# Altium schematic sheet 3 - PSOC & Power.SchDoc
size A3; PageSetup: Record=PageOptions|CenterHorizontal=True|CenterVertical=True|PrintScale=1.00|XCorrection=1.00|YCorrection=1.00|PrintKind=1|BorderSize=5000000|LeftOffset=0|BottomOffset=0|Orientation=2|PaperLength=2970|PaperWidth=2100|Scale=100|PaperSource=7|PrintQuality=-4|MediaType=1|DitherType=10|PaperKind=A4 (210 x 297 mm)|PrintScaleMode=0
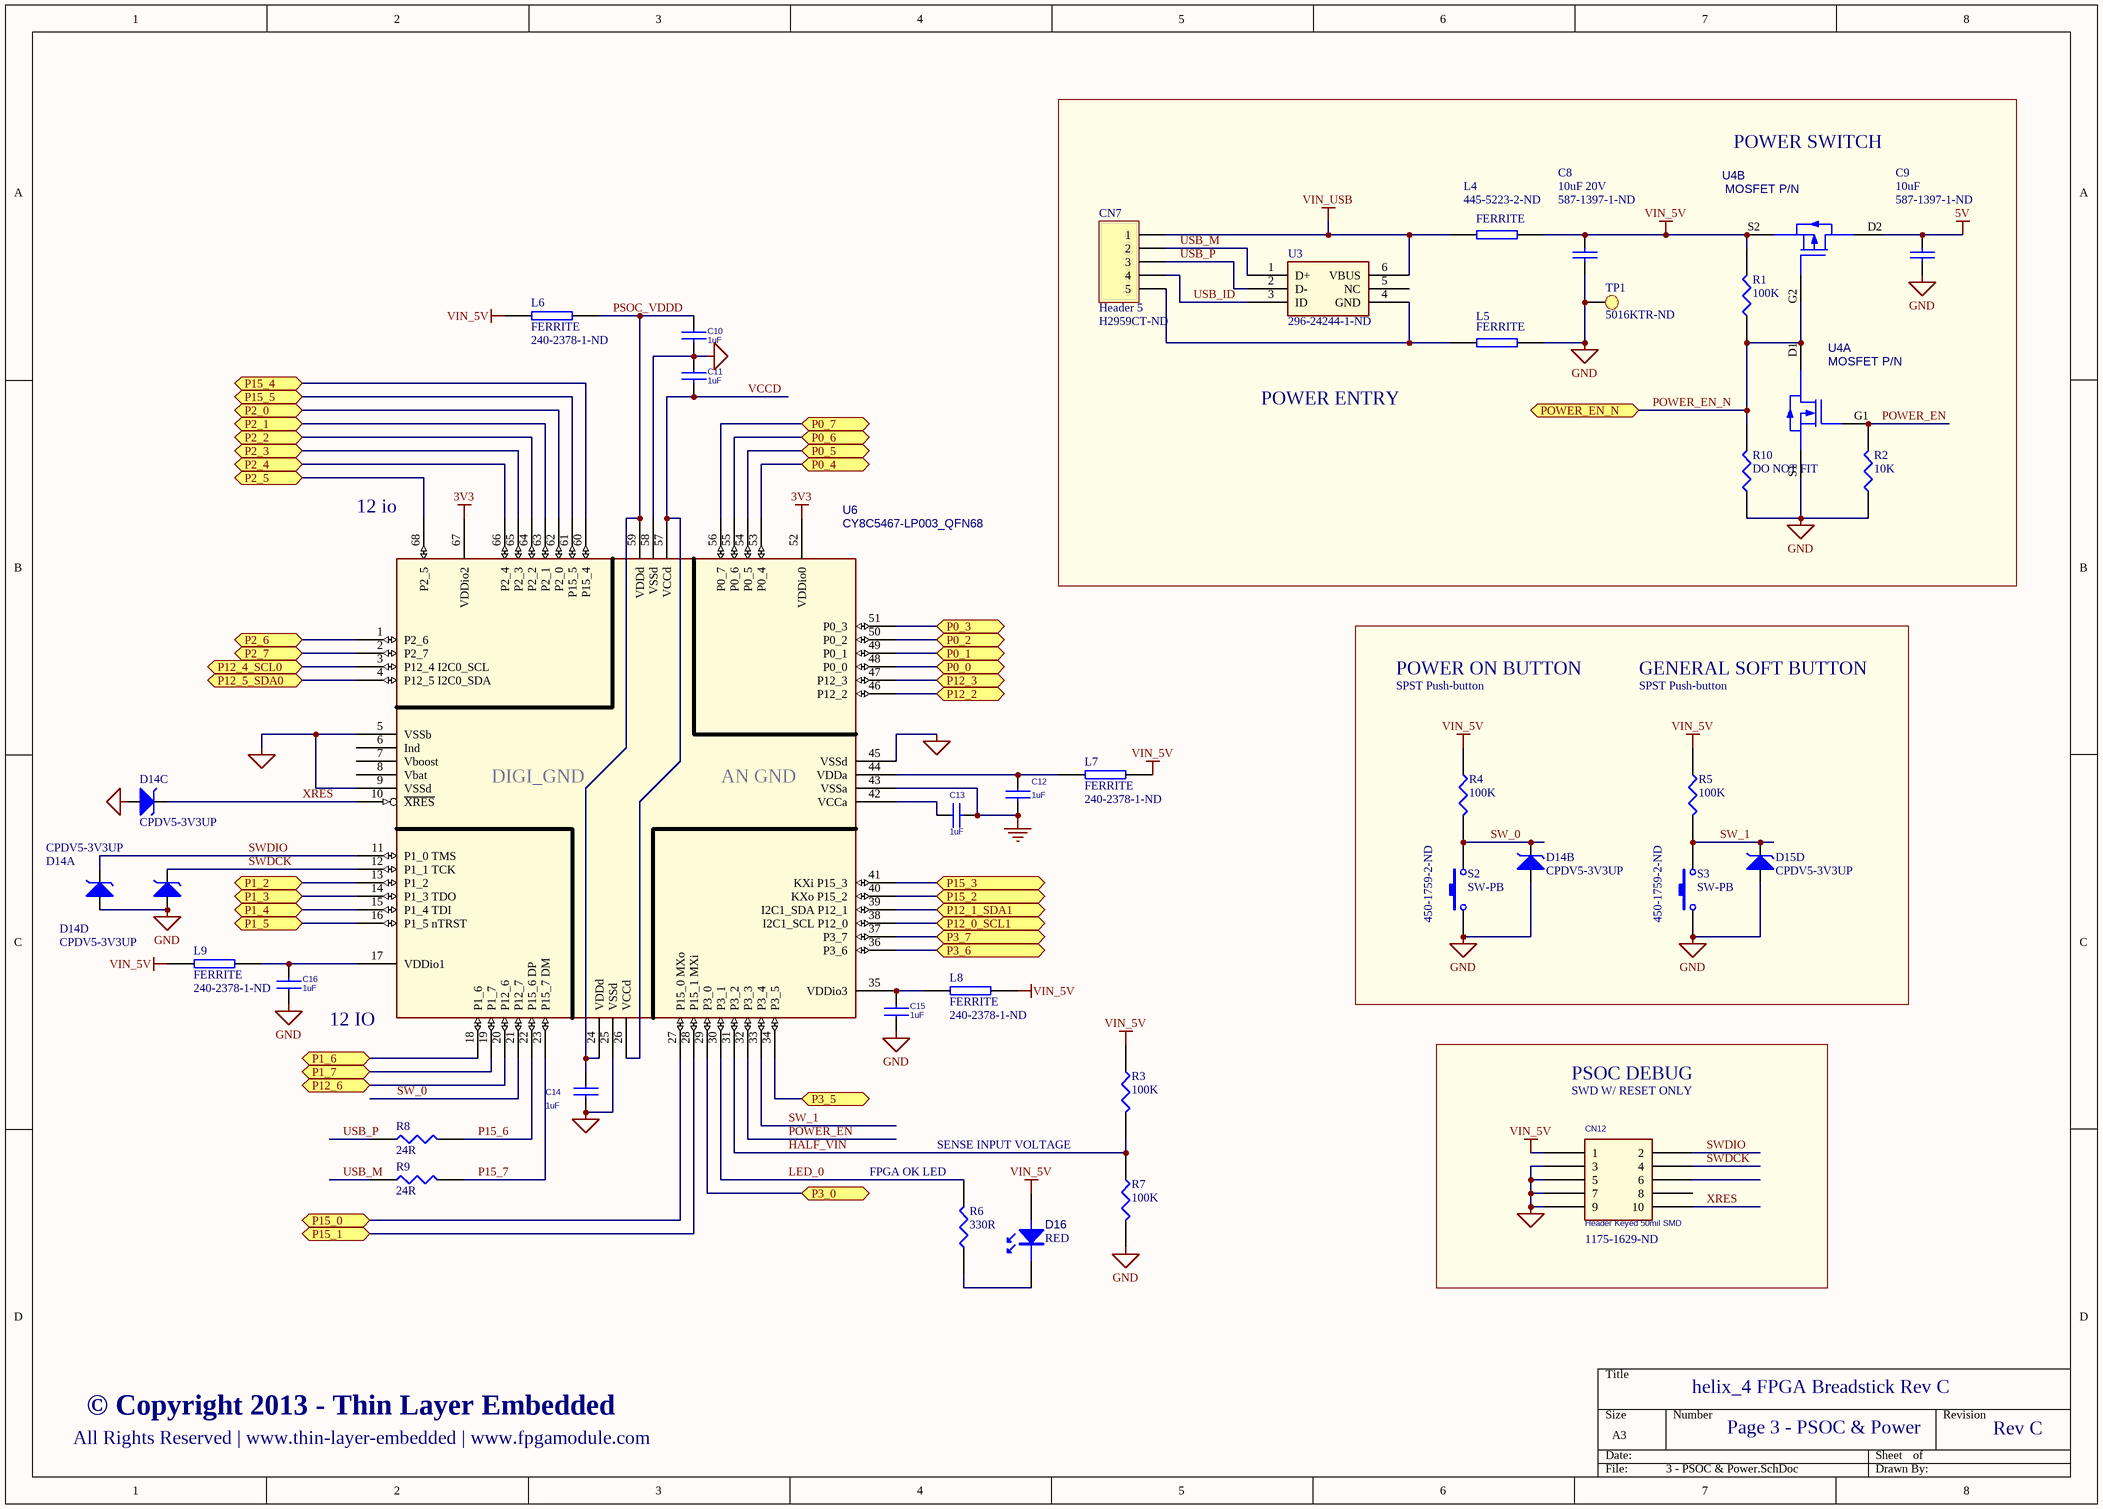
[diagram p0: 3 - PSOC & Power.SchDoc]

## Parts
C8  10uF 20V  Supplier Part Number 1: 587-1397-1-ND  [0805]
C9  10uF  Supplier Part Number 1: 587-1397-1-ND  [0805]
C10  1uF  [0402_HD]
C11  1uF  [0402_HD]
C12  1uF  [0402_HD]
C13  1uF  [0402_HD]
C14  1uF  [0402_HD]
C15  1uF  [0402_HD]
C16  1uF  [0402_HD]
CN7  Header 5  Supplier Part Number 1: H2959CT-ND  [USB_MINI_B]
CN12  Header Keyed 50mil SMD  Supplier Part Number 1: 1175-1629-ND  [SBH41_127_10W_DUAL]
D14  CPDV5-3V3UP  [sot-353]  (parts A,B,C,D of 4)
D15  CPDV5-3V3UP  [sot-353]  (part D of 4)
D16  RED  [0805_HD_LED]
L4  FERRITE  Supplier Part Number 1: 445-5223-2-ND  [0805]
L5  FERRITE  [0805]
L6  FERRITE  Supplier Part Number 1: 240-2378-1-ND  [0402_HD]
L7  FERRITE  Supplier Part Number 1: 240-2378-1-ND  [0402_HD]
L8  FERRITE  Supplier Part Number 1: 240-2378-1-ND  [0402_HD]
L9  FERRITE  Supplier Part Number 1: 240-2378-1-ND  [0402_HD]
R1  100K  [0805]
R2  10K  [0805]
R3  100K  [0805]
R4  100K  [0805]
R5  100K  [0805]
R6  330R  [0805]
R7  100K  [0805]
R8  24R  [0402_HD]
R9  24R  [0402_HD]
R10  DO NOT FIT  [0805]
S2  SW-PB  Supplier Part Number 1: 450-1759-2-ND  [FSM4JSMA]
S3  SW-PB  Supplier Part Number 1: 450-1759-2-ND  [FSM4JSMA]
TP1  Supplier Part Number 2: 5016KTR-ND  [TEST_POINT]  (hidden comment: Test Point)
U3  Supplier Part Number 1: 296-24244-1-ND  [DRY6]  (hidden comment: SN65220 USB TVS SOT23-6_0)
U4  MOSFET P/N  [WSMini6-F1-B]  (parts A,B of 2)
U6  CY8C5467-LP003_QFN68  [PSOC_QFN68_HD]

## Blocks framed on the sheet
PSOC DEBUG: CN12

## Ports
P0_0, P0_1, P0_2, P0_3, P0_4, P0_5, P0_6, P0_7, P1_2, P1_3, P1_4, P1_5, P1_6, P1_7, P2_0, P2_1, P2_2, P2_3, P2_4, P2_5, P2_6, P2_7, P3_0, P3_5, P3_6, P3_7, P12_0_SCL1, P12_1_SDA1, P12_2, P12_3, P12_4_SCL0, P12_5_SDA0, P12_6, P15_0, P15_1, P15_2, P15_3, P15_4, P15_5, POWER_EN_N

## Nets
3V3: U6.52(VDDio0) U6.67(VDDio2)
5V: C9.1 U4.D2
GND: C8.2 C9.2 C10.2 C11.1 C12.2 C13.2 C14.2 C15.1 C16.1 CN12.3 CN12.5 CN12.7 CN12.9 D14.2(A) D15.2(A) L5.2 R2.1 R7.2 R10.1 S2.1 S3.1 TP1.1 U4.S1 U6.5(VSSb) U6.9(VSSd) U6.25(VSSd) U6.43(VSSa) U6.45(VSSd) U6.58(VSSd)
VIN_5V: C8.1 CN12.1 D16.A L4.2 L6.1 L7.2 L8.2 L9.2 R1.2 R3.1 R4.1 R5.1 U4.S2
VIN_USB: CN7.1 L4.1 U3.6(VBUS)
HALF_VIN: R3.2 R7.1 U6.31(P3_2)
LED_0: R6.2 U6.30(P3_1)
P0_0: U6.48(P0_0) ; port P0_0
P0_1: U6.49(P0_1) ; port P0_1
P0_2: U6.50(P0_2) ; port P0_2
P0_3: U6.51(P0_3) ; port P0_3
P0_4: U6.53(P0_4) ; port P0_4
P0_5: U6.54(P0_5) ; port P0_5
P0_6: U6.55(P0_6) ; port P0_6
P0_7: U6.56(P0_7) ; port P0_7
P1_2: U6.13(P1_2) ; port P1_2
P1_3: U6.14(P1_3_TDO) ; port P1_3
P1_4: U6.15(P1_4_TDI) ; port P1_4
P1_5: U6.16(P1_5_nTRST) ; port P1_5
P1_6: U6.18(P1_6) ; port P1_6
P1_7: U6.19(P1_7) ; port P1_7
P2_0: U6.62(P2_0) ; port P2_0
P2_1: U6.63(P2_1) ; port P2_1
P2_2: U6.64(P2_2) ; port P2_2
P2_3: U6.65(P2_3) ; port P2_3
P2_4: U6.66(P2_4) ; port P2_4
P2_5: U6.68(P2_5) ; port P2_5
P2_6: U6.1(P2_6) ; port P2_6
P2_7: U6.2(P2_7) ; port P2_7
P3_0: U6.29(P3_0) ; port P3_0
P3_5: U6.34(P3_5) ; port P3_5
P3_6: U6.36(P3_6) ; port P3_6
P3_7: U6.37(P3_7) ; port P3_7
P12_0_SCL1: U6.38(I2C1_SCL_P12_0) ; port P12_0_SCL1
P12_1_SDA1: U6.39(I2C1_SDA_P12_1) ; port P12_1_SDA1
P12_2: U6.46(P12_2) ; port P12_2
P12_3: U6.47(P12_3) ; port P12_3
P12_4_SCL0: U6.3(P12_4_I2C0_SCL) ; port P12_4_SCL0
P12_5_SDA0: U6.4(P12_5_I2C0_SDA) ; port P12_5_SDA0
P12_6: U6.20(P12_6) ; port P12_6
P15_0: U6.27(P15_0_MXo) ; port P15_0
P15_1: U6.28(P15_1_MXi) ; port P15_1
P15_2: U6.40(KXo_P15_2) ; port P15_2
P15_3: U6.41(KXi_P15_3) ; port P15_3
P15_4: U6.60(P15_4) ; port P15_4
P15_5: U6.61(P15_5) ; port P15_5
P15_6: R8.1 U6.22(P15_6_DP)
P15_7: R9.1 U6.23(P15_7_DM)
POWER_EN: R2.2 U4.G1 U6.32(P3_3)
POWER_EN_N: R1.1 R10.2 U4.D1 U4.G2 ; port POWER_EN_N
PSOC_VDDD: C10.1 C14.1 L6.2 U6.24(VDDd) U6.59(VDDd)
SW_0: D14.1(K2) R4.2 S2.2 U6.21(P12_7)
SW_1: D15.4(K4) R5.2 S3.2 U6.33(P3_4)
SWDCK: CN12.4 D14.4(K4) U6.12(P1_1_TCK)
SWDIO: CN12.2 D14.3(K1) U6.11(P1_0_TMS)
USB_ID: CN7.4 U3.3(ID)
USB_M: CN7.2 R9.2 U3.1(D+)
USB_P: CN7.3 R8.2 U3.2(D-)
VCCD: C11.2 U6.26(VCCd) U6.57(VCCd)
XRES: CN12.10 D14.5(K3) U6.10(~{XRES})
NetC12_1: C12.1 L7.1 U6.44(VDDa)
NetC13_1: C13.1 U6.42(VCCa)
NetC15_2: C15.2 L8.1 U6.35(VDDio3)
NetC16_2: C16.2 L9.1 U6.17(VDDio1)
NetCN7_5: CN7.5 L5.1 U3.4(GND)
NetD16_K: D16.K R6.1

Not connected (* = marked no-connect by the designer): CN12 6 8; U3 5(NC); U6 6(Ind) 7(Vboost) 8(Vbat)

## Notes on the sheet
- POWER SWITCH
- POWER ENTRY
- (near U6) 12 io
- POWER ON BUTTON
- SPST Push-button
- GENERAL SOFT BUTTON
- (near U6) DIGI_GND
- (near U6) AN GND
- (near U6) 12 IO
- SWD W/ RESET ONLY
- (near R6) FPGA OK LED
- SENSE INPUT VOLTAGE
- helix_4 FPGA Breadstick Rev C
- All Rights Reserved | www.thin-layer-embedded | www.fpgamodule.com
- © Copyright 2013 - Thin Layer Embedded
- Page 3 - PSOC & Power
- Rev C

## Library data of the parts
C8 C9 = CAP: Capacitor; Supplier 1: Digi-Key
C10 C12 = CAP: CAP, CER, 10 uF, 16 V, 5%, X5R, 0805, SMD; Part Number: 700-00105; ALT_SYMBOLS: CAPC2012X140N,CAPC2012X140L,CAPC2012X140M; Last Edit By: SNF; CLASS: DISCRETE; Rated Voltage: 16 V; Operating Temperature Maximum: 85 C; Operating Temperature Minimum: -25 C; Package Size: 0805; FPLIST: CAPC2012X140N,CAPC2012X140L,CAPC2012X140M; Tolerance: 5%
C11 C13 C15 C16 = CAP: CAP CER 1.2 uF 10 V 10% X5R 0805 SMD; Part Number: 700-00097; Last Edit By: SNF; CLASS: DISCRETE; FPLIST: CAPC2012X100N,CAPC2012X100L,CAPC2012X100M; Rated Voltage: 10 V; Package Size: 0805; Tolerance: 10%
C14 = CAP: CAP, CER, 1.0 uF, 10 V, 10%, X5R, 0603, SMD; Part Number: 700-00111; ALT_SYMBOLS: CAPC1608X55N,CAPC1608X55L,CAPC1608X55M; Last Edit By: SNF; CLASS: DISCRETE; Rated Voltage: 10 V; Tolerance: 10%; FPLIST: CAPC1608X55N,CAPC1608X55L,CAPC1608X55M; Package Size: 0603; Operating Temperature Minimum: -55 C; Operating Temperature Maximum: 85 C
CN7 = Header 5: Header, 5-Pin; LatestRevisionDate: 17-Jul-2002; LatestRevisionNote: Re-released for DXP Platform.; Publisher: Altium Limited; Supplier 1: Digi-Key
CN12 = HDR_2X5: CONN, HDR, KEYED, 2x5, 0.050", Gold, SMD; Part Number: 400-00018; Last Edit By: SNF; CLASS: IO; ALT_SYMBOLS: ftsh-105-xx-x-dv-k; Package Type: SMD; Operating Temperature Minimum: -55 C; Operating Temperature Maximum: 125 C; Supplier 1: Digi-Key
D14 D15 = 4CH ESD DIODE (SPLIT): 4CH ESD DIODE 3V3/3.5V
D16 = LED: Supplier 1: Digi-Key
L6-L9 = FERRITE: Manufacturer: Laird-Signal Integrity Products; Manufacturer Part Number: HI0805R800R-10; Description: FERRITE CHIP POWER 80 OHM SMD; Impedance @ Frequency: 80 Ohm @ 100MHz; Current Rating: 5A; DC Resistance (DCR): 10.00 mOhm Max; Filter Type: Differential Mode - Single; Number of Lines: 1; Supplier 1: Digi-Key; RoHS: RoHS Compliant; Category: Filters; Stock 1: 36575; Pricing 1: 10=0.089, 50=0.0768, 100=0.0708, 250=0.059, 500=0.0531, 1000=0.0472 (USD); Package / Case: 0805 (2012 metric); Mounting Type: Surface Mount; Packaging: Cut Tape (CT); ComponentLink1URL: http://www.steward.com/view_print.asp?St_PartNo=HI0805R800R-10; ComponentLink1Description: http://www.steward.com/view_print.asp?St_PartNo=HI0805R800R-10
R1-R7 R10 = RES1
R8 R9 = RES1: Manufacturer: Yageo; Manufacturer Part Number: RC0402FR-0724R9L; Description: RES 24.9 OHM 1/16W 1% 0402 SMD; Resistance (Ohms): 24.9; Power (Watts): 0.063W, 1/16W; Temperature Coefficient: ±100ppm/°C; Tolerance: ±1%; Supplier 1: Digi-Key; RoHS: RoHS Compliant; Category: Resistors; Stock 1: 237555; Pricing 1: 10=0.014, 50=0.0104, 100=0.0079, 250=0.00584, 500=0.00432, 1000=0.00288 (USD); Composition: Thick Film; Features: -; Size / Dimension: 0.039" L x 0.020" W (1.00mm x 0.50mm); Height: 0.014" (0.35mm); Number of Terminations: 2; Packaging: Cut Tape (CT); Package / Case: 0402 (1005 Metric); ComponentLink1URL: http://www.yageo.com/documents/recent/PYu-RC0402_51_RoHS_L_6.pdf; ComponentLink1Description: http://www.yageo.com/documents/recent/PYu-RC0402_51_RoHS_L_6.pdf; Supplier 2: Digi-Key; Stock 2: 302870; Pricing 2: 10=0.014, 50=0.0104, 100=0.0079, 250=0.00584, 500=0.00432, 1000=0.00288 (USD); ComponentLink2URL: http://www.yageo.com/documents/recent/PYu-RC0603_51_RoHS_L_4.pdf; ComponentLink2Description: http://www.yageo.com/documents/recent/PYu-RC0603_51_RoHS_L_4.pdf
S2 S3 = SW-PB: Switch; Published: 24-Mar-1999; LatestRevisionDate: 17-Jul-2002; LatestRevisionNote: Re-released for DXP Platform.; PackageReference: SPST-2; Publisher: Altium Limited; Supplier 1: Digi-Key
U4 = PN_PAIR: Supplier 1: Digi-Key
U6 = CY8C38XX_100P_ALT: IC, PSoC3; Part Number: 500-00031; Last Edit By: SNF; ALT_SYMBOLS: tqfpa100; Description: IC, PSoC3, 64K, CY8C3866AXI-040, TQFP-100, SMD; CLASS: IC; Operating Temperature Minimum: -40 C; Operating Temperature Maximum: 85 C; Package Size: TQFP-100
L4 L5 = FERRITE
  L4: Supplier 1: Digi-Key
TP1 = Test Point: Supplier 1: Digi-Key; Supplier 2: Digi-Key
U3 = SN65220 USB TVS SOT23-6_0: Supplier 1: Digi-Key